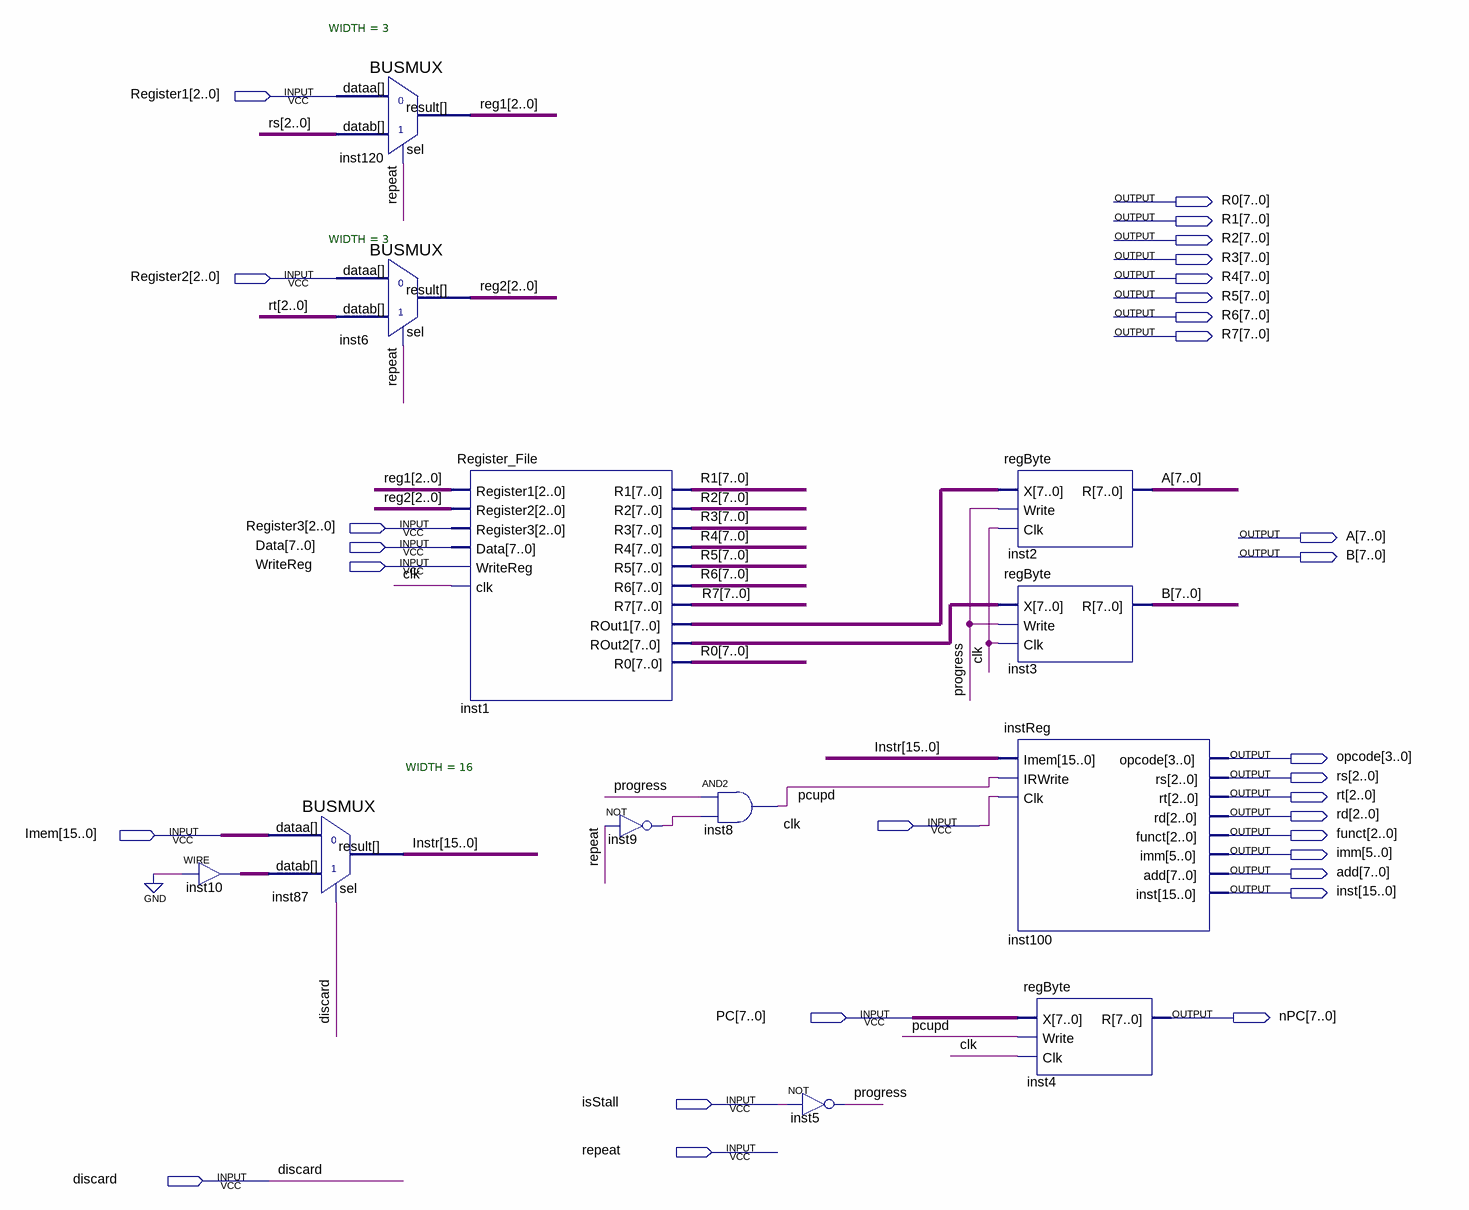
[diagram p0: schematic sheet]
// Quartus schematic RegReadCycle.bdf as structural Verilog: 12 symbols, 30 pins
module RegReadCycle (
  input  [2:0] Register1,
  input  [2:0] Register2,
  input  [2:0] Register3,
  input  [7:0] Data,
  input  WriteReg,
  input  clk,
  input  [15:0] Imem,
  input  [7:0] PC,
  input  isStall,
  input  \repeat ,
  input  discard,
  output [7:0] R0,
  output [7:0] R1,
  output [7:0] R2,
  output [7:0] R3,
  output [7:0] R4,
  output [7:0] R5,
  output [7:0] R6,
  output [7:0] R7,
  output [7:0] A,
  output [7:0] B,
  output [3:0] opcode,
  output [2:0] rs,
  output [2:0] rt,
  output [2:0] rd,
  output [2:0] funct,
  output [5:0] imm,
  output [7:0] add,
  output [15:0] inst,
  output [7:0] nPC
);

  wire inst9_out, pcupd, progress;
  wire [2:0] reg1, reg2;
  wire [7:0] inst1_rout1, inst1_rout2;
  wire [15:0] inst10_out, Instr;

  assign inst10_out = {16{1'b0}};  // WIRE inst10
  BUSMUX #(.WIDTH(16)) inst87 (.datab(inst10_out), .sel(discard), .dataa(Imem), .result(Instr));
  BUSMUX #(.WIDTH(3)) inst120 (.datab(rs), .sel(\repeat ), .dataa(Register1), .result(reg1));
  BUSMUX #(.WIDTH(3)) inst6 (.datab(rt), .sel(\repeat ), .dataa(Register2), .result(reg2));
  Register_File inst1 (
    .Register1(reg1), .Register2(reg2), .Register3(Register3), .Data(Data), .WriteReg(WriteReg), .clk(clk),
    .R1(R1), .R2(R2), .R3(R3), .R4(R4), .R5(R5), .R6(R6), .R7(R7), .ROut1(inst1_rout1), .ROut2(inst1_rout2),
    .R0(R0));
  not inst9 (inst9_out, \repeat );
  and inst8 (pcupd, progress, inst9_out);
  not inst5 (progress, isStall);
  regByte inst2 (.X(inst1_rout1), .Write(progress), .Clk(clk), .R(A));
  regByte inst3 (.X(inst1_rout2), .Write(progress), .Clk(clk), .R(B));
  instReg inst100 (
    .Imem(Instr), .IRWrite(pcupd), .Clk(clk), .opcode(opcode), .rs(rs), .rt(rt), .rd(rd), .funct(funct),
    .imm(imm), .add(add), .inst(inst));
  regByte inst4 (.X(PC), .Write(pcupd), .Clk(clk), .R(nPC));
endmodule
